# EAGLE design ESP_LoRa_Weather (EAGLE 9.5.2)
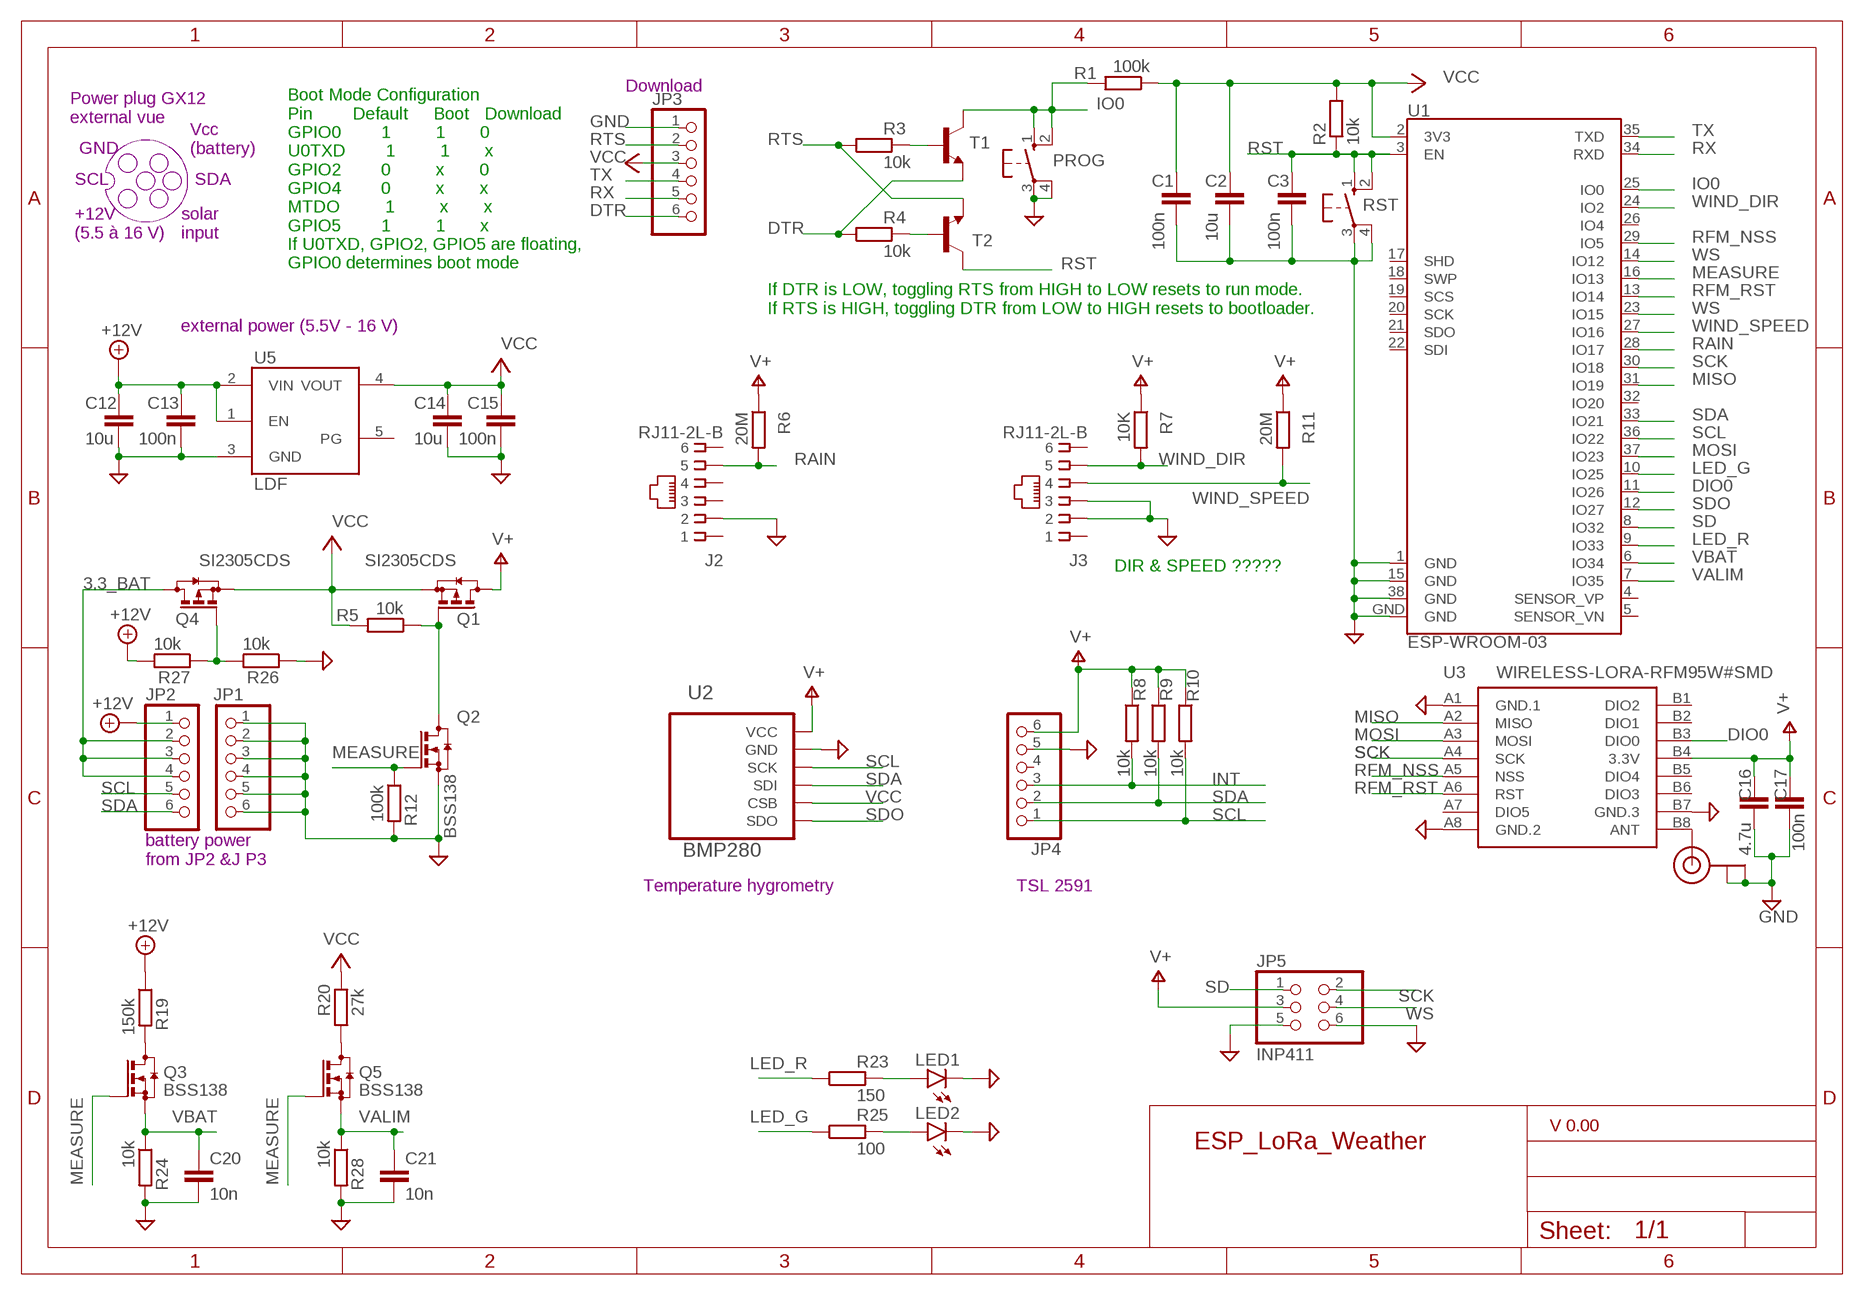
[diagram p0: schematic, sheet 1]

## Parts
C1  100n  CC1206  [C1206]
C2  10u  CC1210  [C1210]
C3  100n  CC1206  [C1206]
C12  10u  CC1210  [C1210]
C13  100n  CC1206  [C1206]
C14  10u  CC1210  [C1210]
C15  100n  CC1206  [C1206]
C16  4.7u  CC1210  [C1210]
C17  100n  CC1206  [C1206]
C20  10n  CC1206  [C1206]
C21  10n  CC1206  [C1206]
J1  U.FL  [U.FL]
J2  RJ11-2L-B  [RJ11-NO_SHIELD]
J3  RJ11-2L-B  [RJ11-NO_SHIELD]
JP1  PINHD-1X6  [1X06]
JP2  PINHD-1X6  [1X06]
JP3  PINHD-1X6  [1X06]
JP4  PINHD-1X6  [1X06]
JP5  INP411  PINHD-2X3  [2X03]
LED1  LEDCHIPLED_0805  [CHIPLED_0805]
LED2  LEDCHIPLED_0805  [CHIPLED_0805]
PROG  10-XX  [B3F-10XX]
Q1  SI2305CDS  [SOT23]
Q2  BSS138  [SOT23]
Q3  BSS138  [SOT23]
Q4  SI2305CDS  [SOT23]
Q5  BSS138  [SOT23]
R1  100k  RR1206  [R1206]
R2  10k  RR1206  [R1206]
R3  10k  RR1206  [R1206]
R4  10k  RR1206  [R1206]
R5  10k  RR1206  [R1206]
R6  20M  RR1206  [R1206]
R7  10K  RR1206  [R1206]
R8  10k  RR1206  [R1206]
R9  10k  RR1206  [R1206]
R10  10k  RR1206  [R1206]
R11  20M  RR1206  [R1206]
R12  100k  RR1206  [R1206]
R19  150k  RR1206  [R1206]
R20  27k  RR1206  [R1206]
R23  150  RR1206  [R1206]
R24  10k  RR1206  [R1206]
R25  100  RR1206  [R1206]
R26  10k  RR1206  [R1206]
R27  10k  RR1206  [R1206]
R28  10k  RR1206  [R1206]
RST  10-XX  [B3F-10XX]
T1  MMBT2222ALT1-NPN-SOT23-BEC  [SOT23-BEC]
T2  MMBT2222ALT1-NPN-SOT23-BEC  [SOT23-BEC]
U1  ESP-WROOM-03  [ESP-WROOM-03]
U2  BMP280  [BMP280]
U3  WIRELESS-LORA-RFM95W#SMD  [WIRELESS-LORA-RFM95W#SMD]
U5  LDF3.3  [PPAK]

## Nets
3.3_BAT: JP2.2 JP2.3 JP2.4 Q4.3(D)
+12V: C12.1 C13.1 JP2.1 R19.1 R27.2 U5.1(EN) U5.2(VIN)
DIO0: U1.11(IO26) U3.B3(DIO0)
DTR: JP3.6 R4.1 T1.E
GND: C1.2 C2.2 C3.2 C12.2 C13.2 C14.2 C15.2 C16.2 C17.2 C20.2 C21.2 J1.1(GND) J1.2(GND) J2.2 J3.2 J3.3 JP1.1 JP1.2 JP1.3 JP1.4 JP1.5 JP1.6 JP3.1 JP4.5 JP5.5 JP5.6 LED1.C LED2.C PROG.3(P) PROG.4(P1) Q2.2(S) R12.2 R24.2 R26.1 R28.2 RST.3(P) RST.4(P1) U1.1(GND) U1.15(GND) U1.38(GND) U1.GND U2.GND U3.A1(GND.1) U3.A8(GND.2) U3.B7(GND.3) U5.3(GND)
INT: JP4.3 R8.2
IO0: PROG.1(S) PROG.2(S1) R1.2 T1.C U1.25(IO0)
LED_G: R25.1 U1.10(IO25)
LED_R: R23.1 U1.9(IO33)
MEASURE: Q2.1(G) Q3.1(G) Q5.1(G) R12.1 U1.16(IO13)
MISO: U1.31(IO19) U3.A2(MISO)
MOSI: U1.37(IO23) U3.A3(MOSI)
N$1: Q1.1(G) Q2.3(D) R5.1
N$2: Q3.3(D) R19.2
N$3: J1.3(SIGNAL) U3.B8(ANT)
N$5: Q5.3(D) R20.1
N$7: LED1.A R23.2
N$8: LED2.A R25.2
N$10: R3.2 T1.B
N$14: R4.2 T2.B
N$35: Q4.1(G) R26.2 R27.1
RAIN: J2.5 R6.2 U1.28(IO17)
RFM_NSS: U1.29(IO5) U3.A5(NSS)
RFM_RST: U1.13(IO14) U3.A6(RST)
RST: C3.1 R2.1 RST.1(S) RST.2(S1) T2.C U1.3(EN)
RTS: JP3.2 R3.1 T2.E
RX: JP3.5 U1.34(RXD)
SCK: JP5.2 U1.30(IO18) U3.A4(SCK)
SCL: JP2.5 JP4.1 R10.2 U1.36(IO22) U2.SCK
SD: JP5.1 U1.8(IO32)
SDA: JP2.6 JP4.2 R9.2 U1.33(IO21) U2.SDI
SDO: U1.12(IO27) U2.SD0(SDO)
TX: JP3.4 U1.35(TXD)
V+: C16.1 C17.1 JP4.6 JP5.3 Q1.3(D) R6.1 R7.1 R8.1 R9.1 R10.1 R11.1 U2.VCC U3.B4(3.3V)
VALIM: C21.1 Q5.2(S) R28.1 U1.7(IO35)
VBAT: C20.1 Q3.2(S) R24.1 U1.6(IO34)
VCC: C1.1 C2.1 C14.1 C15.1 JP3.3 Q1.2(S) Q4.2(S) R1.1 R2.2 R5.2 R20.2 U1.2(3V3) U2.CSB U5.4(VOUT)
WIND_DIR: J3.5 R7.2 U1.24(IO2)
WIND_SPEED: J3.4 R11.2 U1.27(IO16)
WS: JP5.4 U1.14(IO12) U1.23(IO15)
Unconnected: J2.1 J2.3 J2.4 J2.6 J3.1 J3.6 JP4.4 U1.4(SENSOR_VP) U1.5(SENSOR_VN) U1.17(SHD) U1.18(SWP) U1.19(SCS) U1.20(SCK) U1.21(SDO) U1.22(SDI) U1.26(IO4) U1.32(IO20) U3.A7(DIO5) U3.B1(DIO2) U3.B2(DIO1) U3.B5(DIO4) U3.B6(DIO3) U5.5(PG)

## Notes on the sheet
- Download
- Power plug GX12
  external vue
- GND
- Vcc
  (battery)
- SCL | SDA
- +12V
  (5.5 à 16 V)
- solar 
  input
- Boot Mode Configuration
  Pin        Default     Boot   Download
  GPIO0        1         1       0
  U0TXD        1         1       x
  GPIO2        0         x       0
  GPIO4        0         x       x
  MTDO         1         x       x
  GPIO5        1         1       x
  If U0TXD, GPIO2, GPIO5 are floating, 
  GPIO0 determines boot mode
- If DTR is LOW, toggling RTS from HIGH to LOW resets to run mode.
  If RTS is HIGH, toggling DTR from LOW to HIGH resets to bootloader.
- external power (5.5V - 16 V)
- DIR & SPEED ?????
- battery power
  from JP2 &J P3
- Temperature hygrometry | TSL 2591
- V 0.00

## Library data of the parts
C1-C3 C12-C17 C20 C21 = eagle-ltspice:C: CAPACITOR, European symbol; SPICEMODEL: NONE; SPICEPREFIX: C
J1 = microbuilder:U.FL: U.FL Antenna Connector
J2 J3 = con-tycoelectronics:RJ11: CORCOM Modular RJ Jacks No Shield Source: www.tycoelectronics.com .. ENG_DS_1654001_1099_RJ_L_0507.pdf; MF: TYCO ELECTRONICS; MPN: RJ11-2L-B; OC_FARNELL: unknown; OC_NEWARK: 83F4463
JP1-JP4 = pinhead:PINHD-1X6: PIN HEADER
JP5 = pinhead:PINHD-2X3: PIN HEADER
LED1 LED2 = led:LED: LED OSRAM: - CHIPLED LG R971, LG N971, LY N971, LG Q971, LY Q971, LO R971, LY R971 LH N974, LH R974 LS Q976, LO Q976, LY Q976 LO Q996 - Hyper CHIPLED LW Q18S LB Q993, LB Q99A, LB R99A - SideLED LS A670, LO A670, LY A670, LG A670, LP A670 LB A673, LV A673, LT A673, LW A673 LH A674 LY A675 LS A676, LA A676, LO A676, LY A676, LW A676 LS A679, LY A679, LG A679 - Hyper Micro SIDELED® LS Y876, LA Y876, LO Y876, LY Y876 LT Y87S - SmartLED LW L88C, LW L88S LB L89C, LB L89S, LG L890 LS L89K, LO L89K, LY L89K LS L896, LA L896, LO L896, LY L896 - TOPLED LS T670, LO T670, LY T670, LG T670, LP T670 LSG T670, LSP T670, LSY T670, LOP T670, LYG T670 LG T671, LOG T671, LSG T671 LB T673, LV T673, LT T673, LW T673 LH T674 LS T676, LA T676, LO T676, LY T676, LB T676, LH T676, LSB T676, LW T676 LB T67C, LV T67C, LT T67C, LS T67K, LO T67K, LY T67K, LW E67C LS E67B, LA E67B, LO E67B, LY E67B, LB E67C, LV E67C, LT E67C LW T67C LS T679, LY T679, LG T679 LS T770, LO T770, LY T770, LG T770, LP T770 LB T773, LV T773, LT T773, LW T773 LH T774 LS E675, LA E675, LY E675, LS T675 LS T776, LA T776, LO T776, LY T776, LB T776 LHGB T686 LT T68C, LB T68C - Hyper Mini TOPLED® LB M676 - Mini TOPLED Santana® LG M470 LS M47K, LO M47K, LY M47K Source: http://www.osram.convergy.de LUXEON: - LUMILED® LXK2-PW12-R00, LXK2-PW12-S00, LXK2-PW14-U00, LXK2-PW14-V00 LXK2-PM12-R00, LXK2-PM12-S00, LXK2-PM14-U00 LXK2-PE12-Q00, LXK2-PE12-R00, LXK2-PE12-S00, LXK2-PE14-T00, LXK2-PE14-U00 LXK2-PB12-K00, LXK2-PB12-L00, LXK2-PB12-M00, LXK2-PB14-N00, LXK2-PB14-P00, LXK2-PB14-Q00 LXK2-PR12-L00, LXK2-PR12-M00, LXK2-PR14-Q00, LXK2-PR14-R00 LXK2-PD12-Q00, LXK2-PD12-R00, LXK2-PD12-S00 LXK2-PH12-R00, LXK2-PH12-S00 LXK2-PL12-P00, LXK2-PL12-Q00, LXK2-PL12-R00 Source: www.luxeon.com KINGBRIGHT: KA-3528ASYC Source: www.kingbright.com
PROG RST = switch-omron:10-XX: OMRON SWITCH; MPN: B3F-1000; OC_FARNELL: 176432; OC_NEWARK: 36M3542
Q1 Q4 = transistor-small-signal-perso:SI2305CDS: P-CHANNEL MOS FET
Q2 Q3 Q5 = detect:BSS138: N-CHANNEL MOS FET
R1-R12 R19 R20 R23-R28 = eagle-ltspice:R: RESISTOR, European symbol; SPICEMODEL: NONE; SPICEPREFIX: R
T1 T2 = transistor:*-NPN-: NPN Transistror BF959 corrected 2008.03.06
U1 = esp32-sparkfun (1):ESP-WROOM-03; OC_FARNELL: unknown
U2 = BMP280:BMP280: BMP280 Barometer Breakout Board
U3 = diy-modules:WIRELESS-LORA-RFM95W: 868/915 MHz LoRa Radio Transceiver Module based on SX1276 chip Click here to find device on ebay.com <http://www.ebay.com/sch/RFM95W+transceiver>
U5 = LDO:LDF: LDFxx 1 A very low drop voltage regulator

## Board
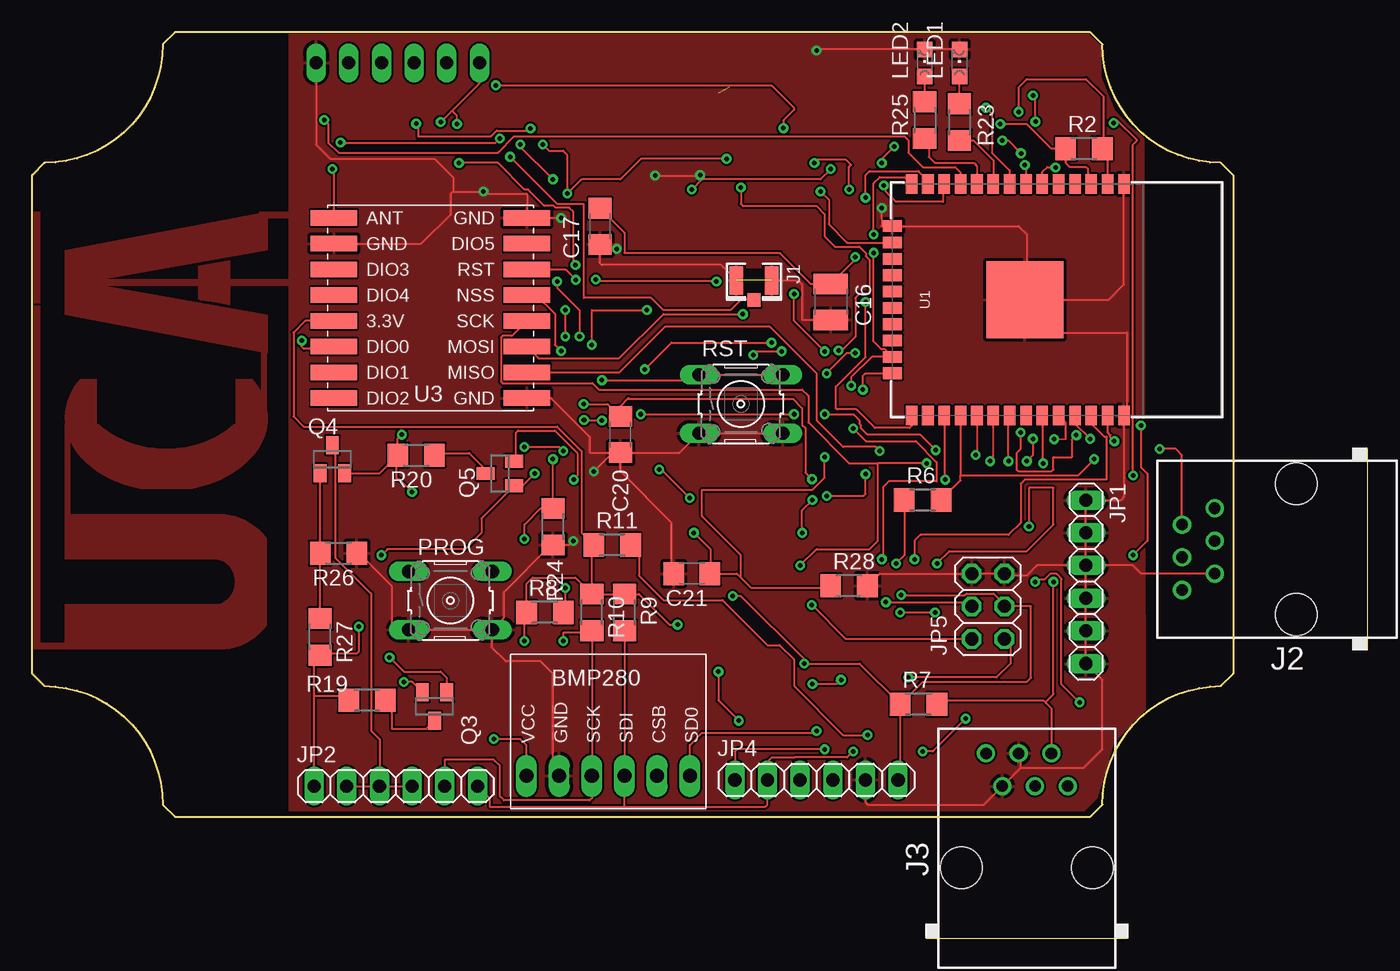
[diagram p1: board, top side]
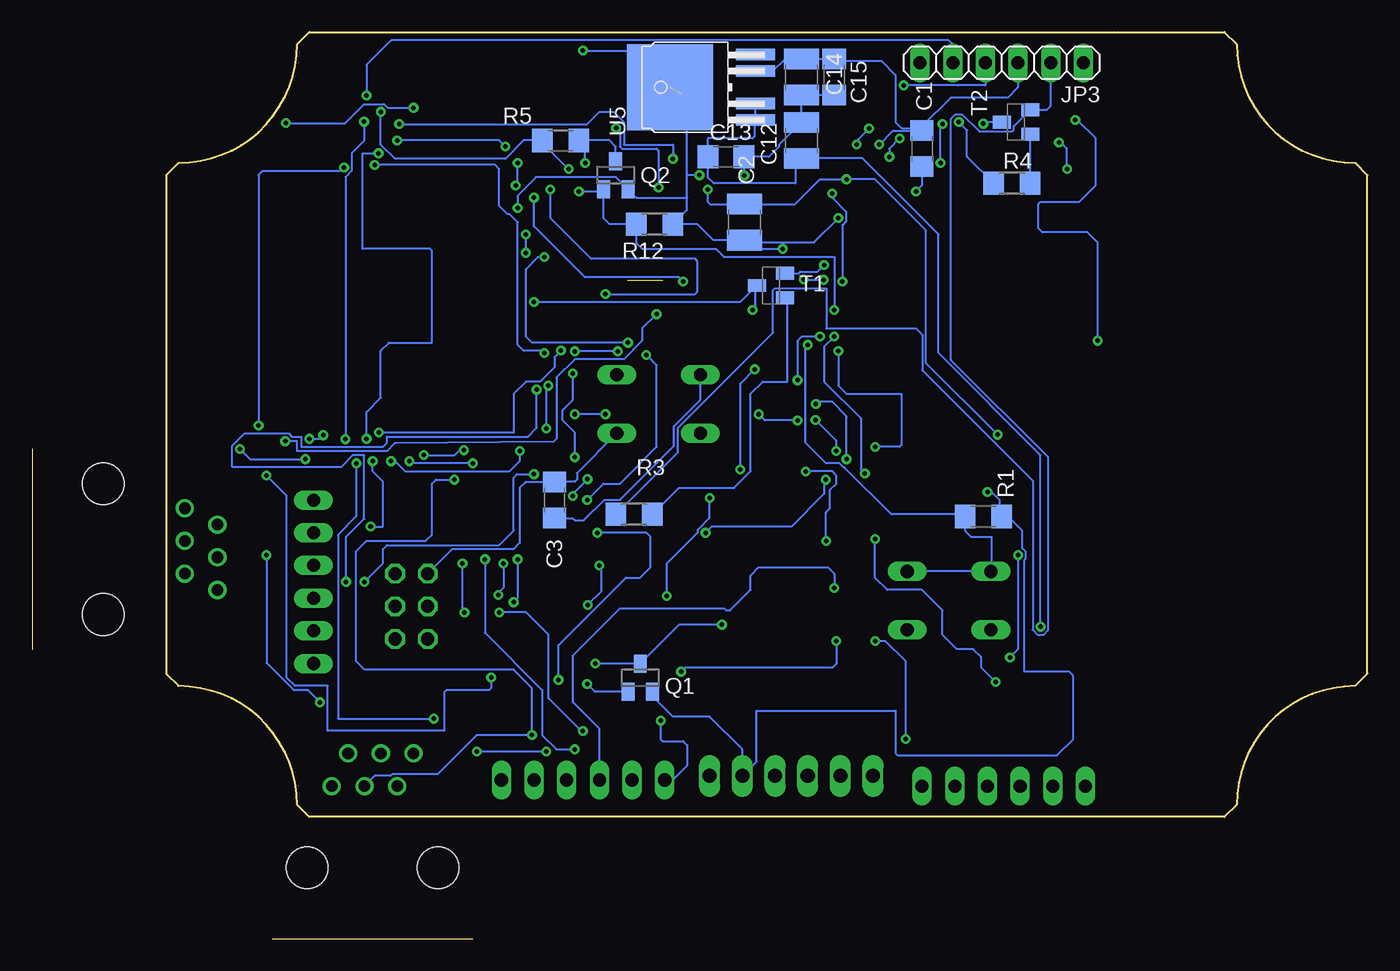
[diagram p2: board, bottom side, seen from below]

Size 93.34 x 60.96 mm. Coordinates in mm from the lower left corner, seen from the top.
Outline: 82.23,60.96 19.37,60.96 11.11,60.96 10.16,60.01 arc-90 0.95,50.8 0,49.85 0,11.11 0.95,10.16 arc-90 10.16,0.95 11.11,0 82.23,0 83.19,0.95 arc-90 92.39,10.16 93.34,11.11 93.34,49.85 92.39,50.8 arc-90 83.19,60.01 82.23,60.96
Copper layers (1*16): Top 0.035mm / dielectric 1.5mm / Bottom 0.035mm
Design rules "default *": minimum track width 6mil, minimum drill 0.35mm, track to track 6mil, track to pad 6mil, pad to pad 6mil, via to via 6mil, smd to smd 6mil, copper to edge 0mil, drill to drill 6mil, minimum pad ring 10mil, minimum via ring 8mil, stop-mask expansion 4mil, vias tented up to drill 0mil, thermal gap 10mil

### Footprints (pad centres in the part's own frame; a part is rotated, then mirrored left to right if it is on the bottom)
C1206 = smd 1.6 x 1.8: 1 -1.4,0; 2 1.4,0
C1210 = smd 1.6 x 2.7: 1 -1.4,0; 2 1.4,0
U.FL = smd 2.2 x 1.05: 1 0,1.375; 2 0,-1.375 | smd 1.05 x 1: 3 1.525,0
RJ11-NO_SHIELD = drill 0.9 pad 1.4: 1 -3.175,8.89; 2 -1.905,6.35; 3 -0.635,8.89; 4 0.635,6.35; 5 1.905,8.89; 6 3.175,6.35 | hole 3.251: -5.08,0; 5.08,0
1X06 = drill 1.016 long: 1 -6.35,0; 2 -3.81,0; 3 -1.27,0; 4 1.27,0; 5 3.81,0; 6 6.35,0
2X03 = drill 1.016 octagon: 1 -2.54,-1.27; 2 -2.54,1.27; 3 0,-1.27; 4 0,1.27; 5 2.54,-1.27; 6 2.54,1.27
CHIPLED_0805 = smd 1.2 x 1.2: A 0,-1.05; C 0,1.05
B3F-10XX = drill 1.016 long: 1 -3.251,2.261; 2 3.251,2.261; 3 -3.251,-2.261; 4 3.251,-2.261
SOT23 = smd 1 x 1.4: 1 -0.95,-1.1; 2 0.95,-1.1; 3 0,1.1
R1206 = smd 1.6 x 1.803: 1 -1.422,0; 2 1.422,0
SOT23-BEC = smd 1 x 1.4: B -0.95,-1.1; C 0,1.1; E 0.95,-1.1
ESP-WROOM-03 = smd 0.9 x 1.5: 1 7.7,9; 2 6.43,9; 3 5.16,9; 4 3.89,9; 5 2.62,9; 6 1.35,9; 7 0.08,9; 8 -1.19,9; 9 -2.46,9; 10 -3.73,9; 11 -5,9; 12 -6.27,9; 13 -7.54,9; 14 -8.81,9; 25 -8.81,-9; 26 -7.54,-9; 27 -6.27,-9; 28 -5,-9; 29 -3.73,-9; 30 -2.46,-9; 31 -1.19,-9; 32 0.08,-9; 33 1.35,-9; 34 2.62,-9; 35 3.89,-9; 36 5.16,-9; 37 6.43,-9; 38 7.7,-9 | smd 1.5 x 0.9: 15 -10.3,5.715; 16 -10.3,4.445; 17 -10.3,3.175; 18 -10.3,1.905; 19 -10.3,0.635; 20 -10.3,-0.635; 21 -10.3,-1.905; 22 -10.3,-3.175; 23 -10.3,-4.445; 24 -10.3,-5.715 | smd 6 x 6: GND 0,0
BMP280 = drill 1.1 long: CSB 2.54,-3.81; GND 2.54,3.81; SCK 2.54,1.27; SD0 2.54,-6.35; SDI 2.54,-1.27; VCC 2.54,6.35
WIRELESS-LORA-RFM95W#SMD = smd 3.6 x 1.2: A1 -7.5,7; A2 -7.5,5; A3 -7.5,3; A4 -7.5,1; A5 -7.5,-1; A6 -7.5,-3; A7 -7.5,-5; A8 -7.5,-7; B1 7.5,7; B2 7.5,5; B3 7.5,3; B4 7.5,1; B5 7.5,-1; B6 7.5,-3; B7 7.5,-5; B8 7.5,-7
PPAK = smd 0.9 x 3: 1 -2.54,-1.5; 2 -1.27,-1.5; 4 1.27,-1.5; 5 2.54,-1.5 | smd 6.7 x 6.7: 3 0,5.15

### Placement (x,y rotation side)
C1  34.61,51.91 270 bottom
C2  48.42,46.2 270 bottom
C3  63.18,24.61 90 bottom
C12  43.97,52.55 90 bottom
C13  49.85,51.28 0 bottom
C14  43.97,57.47 270 bottom
C15  41.43,57.47 270 bottom
C16  62.07,40.01 270 top
C17  44.13,45.88 270 top
C20  45.72,29.69 270 top
C21  51.28,18.89 180 top
J1  56.12,41.68 270 top
J2  98.27,20.8 90 top
J3  77.31,-3.97 0 top
JP1  81.92,18.26 270 top
JP2  28.26,2.38 0 top
JP3  28.42,58.58 180 bottom
JP4  60.96,2.86 0 top
JP5  74.3,16.35 90 top
LED1  72.07,58.58 0 top
LED2  69.37,58.58 0 top
PROG  32.51,16.8 0 top
Q1  56.52,10.79 0 bottom
Q2  58.42,49.85 0 bottom
Q3  31.27,8.57 180 top
Q4  23.34,27.78 0 top
Q5  36.35,26.67 90 top
R1  29.84,23.34 180 bottom
R2  81.76,51.91 0 top
R3  56.99,23.5 0 bottom
R4  27.62,49.21 0 bottom
R5  62.71,52.55 180 bottom
R6  69.22,24.61 0 top
R7  68.9,8.73 0 top
R8  39.85,15.88 0 top
R9  46.04,15.88 270 top
R10  43.5,15.88 270 top
R11  45.09,21.11 0 top
R12  55.4,46.04 0 bottom
R19  26.04,9.05 0 top
R20  29.84,28.1 180 top
R23  72.07,53.98 90 top
R24  40.48,22.54 270 top
R25  69.37,54.13 90 top
R26  23.81,20.48 180 top
R27  22.38,13.97 270 top
R28  63.5,17.94 0 top
RST  55.09,32.07 0 top
T1  46.35,41.27 90 bottom
T2  27.3,53.98 90 bottom
U1  77.16,40.17 0 top
U2  44.77,0.64 90 top
U3  30.96,39.53 180 top
U5  49.05,56.67 90 bottom

### Tracks (layer width: path | path; a pad name or v marks a point on that pad's centre or on a via)
3.3_BAT
  Top 0.152: Q4.3 23.56,28.66 23.56,20.13 26.35,17.34 26.35,6.67 26.99,6.03 JP2.3 | JP2.2 JP2.3 | JP2.3 JP2.4
+12V  (via drill 0.35)
  Top 0.152: JP2.1 21.91,9.37 | 21.91,9.37 21.91,12.07 R27.2 22.54,12.7 25.24,12.7 25.4,12.86 v25.4,14.76 | R19.1 24.3,9.37 21.91,9.37
  Bottom 0.152: U5.2 U5.1 47.62,54.06 47.62,52.86 47.78,52.7 51.28,52.7 51.28,51.3 C13.1 51.25,49.66 50.8,49.21 44.45,49.21 44.45,50.67 C12.1 39.24,51.15 33.34,45.24 33.34,36.04 25.4,28.1 v25.4,14.76
ANT
  pour Top: 14.99,13 0.14,13 0.14,39.7 0.64,39.7 0.64,13.5 2.54,13.5 2.54,16.5 14.19,16.5 14.32,16.51 14.46,16.53 14.59,16.56 14.73,16.61 14.85,16.67 14.97,16.74 15.09,16.82 15.2,16.91 15.3,17.02 15.39,17.13 15.48,17.25 15.55,17.38 15.61,17.51 15.67,17.65 15.71,17.8 15.74,17.95 15.76,18.1 15.76,18.25 15.76,18.41 15.74,18.56 15.71,18.71 15.67,18.85 15.61,18.99 15.55,19.13 15.48,19.25 15.39,19.38 15.3,19.49 15.2,19.59 15.09,19.69 14.97,19.77 14.85,19.84 14.73,19.9 14.59,19.94 14.46,19.98 14.32,20 14.19,20 2.54,20 2.54,30.5 2.57,30.5 2.55,31.11 2.61,31.73 2.75,32.32 2.99,32.92 3.31,33.49 3.72,34 5.03,34 5.03,30.5 5.17,30.5 5.5,30.21 5.85,29.95 6.22,29.7 6.63,29.48 7.06,29.27 7.5,29.1 7.96,28.95 8.44,28.82 8.92,28.73 9.42,28.66 9.92,28.61 10.42,28.6 10.92,28.61 11.42,28.66 11.92,28.73 12.41,28.82 12.88,28.95 13.35,29.1 13.78,29.27 14.21,29.48 14.62,29.7 14.99,29.95 15.34,30.21 15.67,30.5 15.82,30.5 15.82,34 17.13,34 17.25,33.85 17.37,33.69 17.49,33.53 17.59,33.37 17.69,33.21 17.79,33.04 17.79,36.1 2.54,39 2.54,44 17.64,46.87 17.64,47 20.14,47 20.14,46.99 23.99,46.99 23.99,45.99 19.99,45.99 19.99,46.5 18.31,46.5 18.31,44 5.61,41.75 12.91,41.75 12.91,42.8 15.4,43.25 15.4,41.75 19.99,41.75 19.99,42 20.39,42 20.39,41 19.99,41 19.99,41.25 15.4,41.25 15.4,39.75 14.21,39.97 13.08,40.14 13.08,40.17 12.91,40.2 12.91,41.25 5.61,41.25 18.31,39 18.31,36 18.24,36.02 18.24,31.76 18.3,31.22 18.29,30.67 18.21,30.13 18.06,29.58 17.83,29.06 17.55,28.56 17.18,28.07 16.76,27.62 16.3,27.2 15.76,26.8 15.17,26.46 14.57,26.15 13.89,25.88 13.2,25.66 12.49,25.5 8.35,25.5 7.75,25.64 7.15,25.81 6.57,26.03 6.03,26.27 5.51,26.54 5.02,26.85 4.58,27.18 4.16,27.53 3.79,27.92 3.47,28.32 3.19,28.74 2.95,29.18 2.95,23.5 14.99,23.5 14.99,23.49 15.4,23.43 15.81,23.34 16.21,23.21 16.59,23.03 16.96,22.82 17.31,22.58 17.65,22.3 17.96,21.99 18.24,21.65 18.24,14.85 17.96,14.52 17.65,14.2 17.31,13.93 16.96,13.68 16.59,13.47 16.21,13.3 15.81,13.17 15.4,13.07 14.99,13.02
ANT1
  pour Top: 0.64,39.9 0.14,39.9 0.14,47 0.64,47
DIO0  (via drill 0.35)
  Top 0.152: U3.B3 23.28,36.35 21.11,36.35 20.95,36.51 v20.95,36.99 | v22.7,54.13 23.02,53.82 23.02,52.39 23.81,51.59 36.2,51.59 37.47,52.86 67.79,52.86 68.1,52.55 68.1,51.59 69.22,50.48 71.75,50.48 72.16,50.08 U1.11
  Bottom 0.152: v20.95,36.99 20.95,44.61 21.75,45.4 25.24,45.4 25.56,45.72 25.56,47.62 25.4,47.78 22.38,47.78 21.11,49.05 21.11,52.7 22.54,54.13 v22.7,54.13
DTR  (via drill 0.35)
  Top 0.152: v31.75,53.98 32.62,54.85 | 32.62,54.85 34.77,56.99 JP3.6 | v42.23,42.86 42.07,43.02 42.07,46.99 41.74,47.32 40.67,47.32 40.53,47.47 39.8,47.47 38.54,48.72 38.27,48.72 36.2,50.8 v33.18,50.8 | v33.02,53.82 33.02,54.45 32.62,54.85
  Bottom 0.152: R4.1 31.11,51.28 31.11,53.34 v31.75,53.98 | T1.E 44.2,42.23 44.07,42.36 42.73,42.36 v42.23,42.86 | v33.18,50.8 33.18,53.66 v33.02,53.82
GND  (via drill 0.35)  (2 unrouted)
  Top 0.152: 25.4,20.31 R26.1 25.4,20.48 27.94,17.94 27.94,14.61 28.01,14.54 PROG.3 PROG.4 | 38.47,46.51 U3.A8 | 38.47,46.51 38.47,48.37 38.42,48.42 35.24,48.42 v35.08,48.58 32.7,48.58 | U3.B7 30.24,44.53 32.54,46.83 32.54,48.42 32.7,48.58 | JP3.1 22.07,52.23 23.18,51.12 31.27,51.12 32.7,49.69 32.7,48.58 | JP4.5 64.77,1.11 64.93,0.95 73.98,0.95 J3.2 76.83,3.81 | 76.83,3.81 76.83,4.76 J3.3 | 76.83,3.81 81.76,3.81 83.19,5.24 83.19,10.64 JP1.6 JP1.5 JP1.4 81.92,19.37 | 81.92,19.37 JP1.3 | JP1.3 JP1.2 JP1.1 84.61,24.61 84.86,24.86 84.86,31.11 | U1.38 84.86,31.11 | 84.86,31.11 85.09,31.34 85.09,37.62 79.71,37.62 U1.GND 77.31,40.17 | 77.31,40.17 83.67,40.17 84.86,41.37 U1.1 | 77.31,40.17 77.31,45.24 76.67,45.89 U1.15 66.04,45.89 v66.04,47.31 | LED1.C LED2.C 61.06,59.63 v60.96,59.53 | U2.GND 40.48,3.65 40.48,11.11 39.53,12.06 36.83,12.06 35.76,13.13 PROG.4 | J2.2 86.2,18.89 85.57,19.53 82.07,19.53 81.92,19.37 | JP1.3 78.11,19.53 77.31,18.73 75.72,18.73 JP5.5 JP5.6 65.87,18.89 R28.2 | U3.A1 40.34,32.53 43.34,29.53 43.34,28.29 C20.2 | C21.2 49.69,19.08 49.69,22.86 45.72,26.83 45.72,27.94 | 45.72,27.94 C20.2 | C20.2 50.31,28.29 RST.3 RST.4 | v41.12,46.51 38.47,46.51 | v48.42,49.82 51.88,49.82 v51.91,49.85 | J1.1 59.56,41.68 59.85,41.38 59.85,38.6 C16.2 | J1.2 53.53,42.89 44.32,42.89 44.29,42.86 44.13,43.02 44.13,44.13 | PROG.4 36.67,15.44 36.67,17.46 40.33,21.12 R24.2 41.76,21.12 v42.07,21.43 | v43.66,26.83 44.77,27.94 45.72,27.94 | 44.13,44.13 C17.2 | v45.43,44.13 44.13,44.13
  Bottom 0.152: 52.07,54.93 53.34,56.2 | 63.88,26.71 63.2,26.02 | 63.2,26.02 C3.2 65.43,26.01 65.88,25.56 65.88,21.27 66.36,20.8 71.12,20.8 JP5.6 | C12.2 45.11,53.95 | C12.2 43.53,53.5 | C12.2 C14.2 C15.2 | C12.2 45.72,52.2 45.72,52.07 46.51,51.28 C13.2 48.45,49.85 v48.42,49.82 | C1.2 34.61,49.05 v35.08,48.58 | 52.86,48.1 52.86,47.16 R12.2 52.07,46.04 50.83,44.8 C2.2 | 52.86,48.1 52.86,49.85 | 52.86,49.85 52.86,55.33 U5.3 57.06,59.53 v60.96,59.53 | 52.86,48.1 56.82,48.1 Q2.2 58.41,49.69 64.61,49.69 66.04,48.26 v66.04,47.31 | RST.4 61.44,26.71 61.44,26.19 61.61,26.02 63.2,26.02 | C2.2 48.26,44.64 42.99,44.64 v41.12,46.51 | v51.91,49.85 52.86,49.85 | v42.07,21.43 42.07,23.65 41.75,23.97 41.75,25.4 41.27,25.88 41.27,26.51 41.59,26.83 v43.66,26.83 | C2.2 47.76,44.13 v45.43,44.13
  pour Top: 20,0.48 20,60.8 82.07,60.8 83.03,59.85 83.03,57.47 84.06,54.89 85.3,53.57 86.04,53.02 86.36,52.7 86.48,8.3 85.69,7.56 83.98,5.71 82.71,1.43 81.76,0.48
INT  (via drill 0.35)
  Top 0.152: v41.43,17.78 41.43,16.04 R8.2
  Bottom 0.152: JP4.3 59.69,6.83 61.75,8.89 61.75,12.54 58.1,16.19 50.01,16.19 49.85,16.03 49.53,16.03 47.94,17.62 47.94,18.73 47.31,19.37 41.91,19.37 41.43,18.89 v41.43,17.78
IO0  (via drill 0.35)
  Top 0.152: 68.26,31.08 U1.25 68.35,30.38 68.19,30.22 65.5,30.22 64.07,31.65 62.56,31.65 62.47,31.74 62.47,33.42 | v64.77,40.01 64.77,35.72 62.47,33.42 | 62.47,33.42 62.45,33.4 | v43.5,36.67 43.5,39.37 v47.78,39.37
  Bottom 0.152: PROG.2 PROG.1 29.21,19.11 29.21,21.75 30.8,21.75 31.27,22.22 R1.2 31.43,23.5 36.99,23.5 40.67,27.17 40.73,27.17 41.02,27.46 42.07,27.46 43.66,29.05 43.66,36.51 v43.5,36.67 | v64.77,40.01 48.73,40.01 47.54,41.19 | 47.54,41.19 T1.C | v47.78,39.37 47.54,39.61 47.54,41.19
LED_G
  Top 0.152: R25.1 69.69,52.39 69.69,51.28 70.17,50.8 73.18,50.8 73.43,50.55 U1.10
LED_R
  Top 0.152: R23.1 73.18,52.55 74.7,51.03 U1.9
MEASURE  (via drill 0.35)
  Top 0.152: v27.15,20.32 27.62,20.8 33.66,20.8 34.92,22.07 34.92,23.19 Q5.1 38.1,25.72 v39.05,26.67 | v27.78,12.38 28.89,11.27 31.75,11.27 32.22,10.8 Q3.1 | v61.28,48.58 61.91,47.94 61.91,46.04 63.33,44.62 U1.16 | v41.43,39.37 v41.43,37.31
  Bottom 0.152: v27.78,12.38 27.15,13.02 v27.15,20.32 | v61.28,48.58 59.54,48.58 Q2.1 59.37,46.51 58.9,46.04 R12.1 56.83,44.6 56.36,44.13 50.64,44.13 50.01,43.5 41.43,43.5 v41.43,39.37 | v41.43,37.31 42.23,36.51 42.23,33.81 39.37,30.96 39.37,26.99 v39.05,26.67
MISO  (via drill 0.35)
  Top 0.152: U3.A2 45.64,34.53 49.21,38.1 57.31,38.1 60.96,34.45 60.96,30.8 63.02,28.73 65.56,28.73 v65.88,28.42 | v75.88,27.62 75.88,31.08 U1.31
  Bottom 0.152: v65.88,28.42 65.88,27.62 66.67,26.83 74.77,26.83 75.56,27.62 v75.88,27.62
MOSI  (via drill 0.35)
  Top 0.152: U3.A3 39.4,35.59 45.59,35.59 49.05,39.05 v55.24,39.05 | v84.11,29.18 83.81,29.48 83.81,29.65 83.59,29.87 U1.37
  Bottom 0.152: v55.24,39.05 56.36,37.94 56.36,36.99 57.78,35.56 61.59,35.56 63.02,34.13 63.02,29.37 63.24,29.16 75.59,29.02 76.2,28.42 83.19,28.42 83.19,29.19 v84.11,29.18
N$1  (via drill 0.35)
  Top 0.152: v60.64,10.32 62.55,10.32 v62.87,10.64 | v59.85,22.07 59.85,23.81 v60.64,24.61 | v56.04,35.88 56.33,36.17 v58.26,36.17 | v61.59,36.17 59.21,38.55 v59.21,40.61 | v63.5,48.74 63.5,50.48 63.66,50.64 63.26,51.04 61.04,51.04 v60.8,50.8
  Bottom 0.152: Q2.3 58.42,52.07 58.9,52.55 R5.1 60.8,52.06 v60.8,50.8 | Q1.1 60.02,9.7 v60.64,10.32 | v62.87,10.64 62.87,13.34 57.63,18.57 56.52,18.57 55.72,19.37 55.72,21.75 56.04,22.07 v59.85,22.07 | v60.64,24.61 59.37,25.88 58.1,25.88 55.24,28.73 55.24,35.08 v56.04,35.88 | v58.26,36.17 v61.59,36.17 | v59.21,40.61 52.26,40.61 52.07,40.8 52.07,43.18 52.23,43.34 60.33,43.34 63.5,46.51 v63.5,48.74
N$2
  Top 0.152: R19.2 27.94,8.57 27.94,6.83 30.63,6.83 Q3.3
N$3  (via drill 0.35)
  Top 0.152: 23.41,46.57 U3.B8 23.46,50.2 v23.34,50.32 | J1.3 55.07,40.15 54.29,39.37 49.05,39.37 48.1,40.32 42.86,40.32 42.86,47.62 40.8,47.62 v37.15,51.28 | v23.97,52.39 36.04,52.39 v36.35,52.7
  Bottom 0.152: v23.34,50.32 23.34,51.91 23.81,52.39 v23.97,52.39 | v36.35,52.7 37.15,51.91 v37.15,51.28
N$5
  Top 0.152: R20.1 31.43,28.26 33.97,28.26 35.25,26.98 Q5.3
N$7
  Top 0.152: R23.2 LED1.A
N$8
  Top 0.152: R25.2 LED2.A
N$10
  Bottom 0.152: R3.2 53.51,25.56 49.21,25.56 47.94,26.83 47.94,32.86 46.99,33.81 45.09,33.81 45.09,40.16 T1.B
N$14
  Bottom 0.152: R4.2 T2.B
N$35
  Top 0.152: Q4.1 R26.2 R27.1
RAIN  (via drill 0.35)
  Top 0.152: R6.2 72.16,26.13 72.16,26.51 | J2.5 89.38,28.1 88.9,28.57 v87.63,28.57 | v82.55,27.78 81.28,26.51 72.16,26.51 | U1.28 72.16,26.51
  Bottom 0.152: v87.63,28.57 86.84,27.78 v82.55,27.78
RFM_NSS  (via drill 0.35)
  Top 0.152: U1.29 73.43,28.19 v73.34,28.1 | v70.23,28.48 69.03,29.69 64.93,29.69 64.42,30.19 64.42,30.41 64.29,30.54 64.29,30.8 63.82,31.27 v61.59,31.27 | U3.A5 39.18,40.53 40.64,39.07 40.64,36.67 v41.12,36.2 | v38.26,28.73 40.96,28.73 v41.27,28.42 | v42.9,30.83 42.93,30.8 v44.29,30.8 | v47.31,31.27 v59.21,31.27
  Bottom 0.152: v73.34,28.1 70.93,28.1 70.39,28.64 v70.23,28.48 | v41.12,36.2 41.12,33.5 40.48,32.86 36.2,32.86 36.2,28.89 36.35,28.73 v38.26,28.73 | v41.27,28.42 41.27,29.21 v42.9,30.83 | v44.29,30.8 46.83,30.8 v47.31,31.27 | v59.21,31.27 v61.59,31.27
RFM_RST  (via drill 0.35)
  Top 0.152: U3.A6 41.44,42.53 v42.26,41.72 | v53.18,41.59 43.97,41.59 v43.81,41.75 | v64.77,48.1 64.77,49.85 65.09,50.16 68.9,50.16 69.62,49.44 U1.13
  Bottom 0.152: v43.81,41.75 43.78,41.72 v42.26,41.72 | v53.18,41.59 53.5,41.91 60.8,41.91 64.77,45.88 v64.77,48.1
RST  (via drill 0.35)
  Top 0.152: U1.3 82.07,49.42 82.07,50.32 81.92,50.48 80.64,50.48 80.33,50.79 R2.1 79.22,51.91 77.31,53.82 v75.25,53.82 | RST.1 51.91,34.33 | 51.91,34.33 RST.2 | v29.84,53.85 30,53.69 30,52.86 35.66,52.86 36.1,53.31 38.58,53.31 v38.73,53.47 | v39.69,52.23 40.16,51.75 41.27,51.75 41.59,51.44 v41.59,48.42 42.7,49.53 45.72,49.53 47.31,51.12 v53.98,51.12 | v40.8,41.59 40.8,41.12 42.55,39.37 v42.55,37.31 | v44.29,33.92 51.51,33.92 51.91,34.33
  Bottom 0.152: C3.1 61.78,23.21 61.59,23.02 60.91,23.02 59.31,24.62 58.08,24.62 53.89,28.82 53.89,30.34 51.84,32.4 RST.1 | T2.C 29.69,53.98 29.84,53.82 v29.84,53.85 | v38.73,53.47 39.69,52.52 v39.69,52.23 | v41.59,48.42 41.59,48.1 40.51,47.02 40.51,46.26 40.8,45.97 v40.8,41.59 | v42.55,37.31 43.97,37.31 44.29,36.99 v44.29,33.92 | v75.25,53.82 60.64,53.82 59.69,54.77 58.58,54.77 57.78,53.98 57.78,52.23 53.98,52.23 v53.98,51.12
RTS
  Bottom 0.152: JP3.2 24.61,55.24 24.93,54.92 T2.E 27.48,53.65 27.48,53.38 27.61,53.25 30.16,53.25 31.5,54.58 32,54.58 32.36,54.23 32.36,35.49 24.79,27.92 24.79,14.51 25.15,14.16 25.65,14.16 26.01,14.51 26.01,26.1 34.59,34.69 34.59,37.45 35.08,37.94 42.04,37.94 42.04,41.05 46.05,41.05 46.18,40.92 46.18,37.62 53.59,30.22 53.59,28.32 R3.1
RX  (via drill 0.35)
  Top 0.152: v77.79,56.04 77.95,55.88 77.95,53.98 v77.98,54.01 | v79.43,29.34 80.33,29.37 80.33,30.63 U1.34
  Bottom 0.152: JP3.5 32.23,60.01 32.55,60.33 75.88,60.33 77.79,58.42 v77.79,56.04 | v77.98,54.01 77.98,52.51 78.93,51.57 78.93,50.2 79.43,49.7 v79.43,29.34
SCK  (via drill 0.35)
  Top 0.152: JP5.2 63.25,13.81 v60.59,16.46 | U3.A4 37.28,37.36 36.56,37.36 36.43,37.22 36.43,33.83 36.56,33.7 43.54,33.7 44.06,33.18 59.85,33.18 60.33,32.7 60.33,30.64 63.5,27.46 65.72,27.46 | v74.45,27.62 74.7,27.87 U1.30 | v69.53,27.46 65.72,27.46 | v59.69,19.53 60.96,20.8 65.09,20.8 65.72,21.43 65.72,27.46
  Bottom 0.152: v69.53,27.46 74.3,27.46 v74.45,27.62 | v60.59,16.46 59.53,17.53 59.53,19.37 v59.69,19.53
SCL  (via drill 0.35)
  Top 0.152: JP2.5 32.07,4.45 35.88,4.45 36.35,3.97 36.35,1.59 36.67,1.27 43.34,1.27 43.5,1.43 U2.SCK R10.2 43.33,14.29 41.27,14.29 v41.27,13.65 | U1.36 82.32,30.55 83.34,29.53 83.5,29.53 83.5,26.19 77.15,26.19 76.83,25.88 76.83,22.86 75.88,21.91 69.06,21.91 68.58,21.43 v68.58,20 | v61.59,5.24 54.77,5.24 54.61,5.08 JP4.1 | v53.34,11.27 53.34,9.05 v54.93,7.46
  Bottom 0.152: v68.58,20 68.58,14.29 64.14,9.84 64.14,6.35 63.02,5.24 v61.59,5.24 | v41.27,13.65 41.27,11.91 41.59,11.59 53.02,11.59 v53.34,11.27 | v54.93,7.46 54.93,6.03 54.77,5.87 53.18,5.87 52.86,5.56 52.86,3.97 53.98,2.86 JP4.1
SD  (via drill 0.35)
  Top 0.152: JP5.1 76.04,13.34 76.04,11.91 74.96,10.82 v68.1,10.82 | v85.57,26.51 85.57,52.23 85.88,52.55 84.3,54.13 v84.06,53.9 | v74.14,55.09 74.61,54.61 74.61,51.59 75.97,50.23 U1.8
  Bottom 0.152: v68.1,10.82 68.1,10 68.26,9.84 71.6,9.84 71.75,9.68 71.75,6.67 80.8,6.67 80.8,10.16 83.34,10.16 83.98,10.79 83.98,24.92 v85.57,26.51 | v84.06,53.9 79.45,53.9 77.97,55.38 76.42,55.38 76.14,55.09 v74.14,55.09
SDA  (via drill 0.35)
  Top 0.152: R9.2 U2.SDI 46.04,0.79 | JP2.6 35.56,1.43 35.56,0.79 46.04,0.79 | 46.04,0.79 56.99,0.79 57.15,0.95 JP4.2 57.15,4.29 57.47,4.6 59.27,4.6 59.28,4.61 63.35,4.61 v63.82,5.08 | U1.33 78.51,27.46 v78.58,27.46 | v72.55,7.62 70.01,5.08 v69.22,5.08
  Bottom 0.152: v78.58,27.46 78.58,23.34 80.01,21.91 80.01,7.62 v72.55,7.62 | v69.22,5.08 v63.82,5.08
SDO  (via drill 0.35)
  Top 0.152: U2.SD0 51.12,5.56 52.07,6.51 60.8,6.51 v60.96,6.67 | v67.47,15.88 v70.17,15.88 | v70.33,19.68 71.28,20.64 77.31,20.64 79.38,22.7 79.38,25.56 77.47,25.56 v77.47,22.54 | v77.31,27.62 77.79,28.1 v77.79,29.37 | U1.12 70.8,49.08 70.8,47.78 67.15,47.78 66.36,48.58 66.36,49.05 v66.2,49.05 | v66.04,50.8 66.04,51.12 v66.99,52.07 | v75.41,52.55 75.86,52.55 v76.86,51.55
  Bottom 0.152: v60.96,6.67 61.12,6.67 63.66,9.21 63.66,14.13 65.41,15.88 v67.47,15.88 | v70.17,15.88 70.33,16.03 v70.33,19.68 | v77.47,22.54 76.52,22.54 76.52,26.04 77.31,26.83 v77.31,27.62 | v77.79,29.37 77.79,31.43 76.68,32.54 76.68,36.2 76.04,36.83 72.71,36.83 72.71,43.97 72.87,44.13 78.11,44.13 78.11,51.55 v76.86,51.55 | v66.2,49.05 66.04,49.21 v66.04,50.8 | v66.99,52.07 67.47,52.55 v75.41,52.55
TX  (via drill 0.35)
  Top 0.152: U1.35 81.05,30.55 v82.23,29.37 | v36.04,56.83 57.47,56.83 59.21,55.09 59.21,54.93 58.39,54.11 v58.39,53.5 | v55.09,48.9 55.09,47.62 55.24,47.47 60.96,47.47 61.59,46.83 61.59,45.09 62.39,44.29 64.29,44.29 64.8,43.79 64.8,43.56 65.09,43.27 65.09,40.64 64.29,40.64 63.98,40.32 63.98,37.31 62.89,36.22 v62.67,36.22 | v81.16,29.65 80.8,29.29 80.8,27.94 79.38,27.94 79.38,26.99 79.22,26.83 76.68,26.83 76.52,26.99 76.52,28.26 76.83,28.57 v76.83,29.85
  Bottom 0.152: v82.23,29.37 81.44,29.37 v81.16,29.65 | JP3.4 29.69,56.83 31.81,56.83 31.82,56.83 35.18,56.83 v36.04,56.83 | v58.39,53.5 58.1,53.21 58.1,52.07 57.94,51.91 55.24,51.91 55.09,51.75 v55.09,48.9 | v62.67,36.22 63.18,35.71 63.18,34.92 64.29,33.81 65.41,33.81 66.36,32.86 66.36,29.84 v76.82,29.84 v76.83,29.85
V+  (via drill 0.35)
  Top 0.152: 23.5,38.58 U3.B4 21.23,38.53 20.32,37.62 20.32,31.11 21.11,30.32 40.8,30.32 42.7,28.42 42.7,22.07 R11.1 | R7.1 67.47,3.02 JP4.6 | R7.1 64.3,11.91 v60.01,11.91 60.01,12.22 55.09,17.14 v54.45,17.14 | U2.VCC 38.42,5.56 37.94,6.03 v35.88,6.03 | v38.26,13.65 38.26,15.71 R8.1 38.42,18.09 38.42,18.1 38.89,18.57 42.22,18.57 R10.1 | R10.1 R9.1 47.16,17.3 49.53,14.92 v50.16,14.92 | R10.1 43.5,20.95 R11.1 | R11.1 | C17.1 46.04,45.37 46.04,43.79 58.13,43.79 60.51,41.41 C16.1 63.98,43.31 v63.98,43.5 | R7.1 69.22,10.48 77.31,10.48 77.63,10.79 77.63,16.35 75.72,16.35 | 75.72,16.35 JP5.3 | R6.1 67.79,20.33 v67.15,19.68 | v67.55,17.22 72.5,17.22 72.61,17.34 74.73,17.34 75.72,16.35 | v51.12,24.77 48.9,26.99 v48.74,26.99 | v47.62,34.77 49.69,36.83 v57.47,36.83
  Bottom 0.152: v60.01,11.91 60,11.89 Q1.3 53.49,14.92 v50.16,14.92 | v35.88,6.03 35.88,12.06 37.47,13.65 v38.26,13.65 | v67.15,19.68 67.15,17.78 67.63,17.3 v67.55,17.22 | v54.45,17.14 54.45,19.68 52.04,22.09 52.04,22.32 51.12,23.24 v51.12,24.77 | v48.74,26.99 48.74,33.66 v47.62,34.77 | v57.47,36.83 64.93,36.83 65.41,37.31 65.41,42.55 64.45,43.5 v63.98,43.5
VALIM  (via drill 0.35)
  Top 0.152: C21.1 52.7,18.89 | 52.7,18.89 54.77,18.89 55.09,18.57 | 55.09,18.57 55.88,17.78 61.92,17.78 R28.1 | Q5.2 37.62,27.79 37.62,29.84 37.78,30 40.64,30 42.39,28.26 42.39,26.48 v42.1,26.19 | v51.44,22.07 52.7,20.8 52.7,18.89 | 55.09,18.57 55.09,20.32 52.07,23.34 52.07,25.4 60.64,25.4 61.59,26.35 v61.59,27.94 | v61.75,34.45 63.34,36.04 v63.98,36.04 | v77.15,50.64 77.24,50.55 U1.7
  Bottom 0.152: v42.1,26.19 42.23,26.06 42.23,25.08 44.77,22.54 50.96,22.54 v51.44,22.07 | v61.59,27.94 61.59,29.84 62.55,30.8 62.55,31.59 61.75,32.38 v61.75,34.45 | v63.98,36.04 64.14,36.2 65.56,36.2 66.04,36.67 66.04,46.2 66.67,46.83 66.83,46.83 67.47,47.47 67.47,50.32 67.79,50.64 v77.15,50.64
VBAT  (via drill 0.35)
  Top 0.152: Q3.2 29.52,10.48 v28.89,10.48 | v38.26,21.59 38.26,22.7 39.52,23.96 R24.1 v40.48,27.78 | v42.86,32.07 44.74,32.07 C20.1 45.72,31.91 46.28,32.46 | 46.28,32.46 46.35,32.54 | 46.28,32.46 59.13,32.46 59.85,31.75 59.85,30.46 60.09,30.22 60.09,26.75 v60.61,26.23 | v61.75,24.92 64.61,24.92 64.77,25.08 v64.77,26.61 | U1.6 78.51,50.1 78.9,50.48 79.5,50.48 v79.53,50.45 | v86.17,30.39 86.17,27.17 86.68,26.67 86.68,21.43 v85.57,20.32 | v81.41,8.89 80.01,10.29 80.01,18.48 79.63,18.86 79.12,18.86 78.68,18.41 77.95,18.41 v77.95,18.26
  Bottom 0.152: v28.89,10.48 30,11.59 30,12.38 30.64,13.02 31.91,13.02 33.02,14.13 33.02,16.03 34.61,17.62 37.31,17.62 38.26,18.57 v38.26,21.59 | v40.48,27.78 40.48,31.11 41.59,32.23 42.7,32.23 v42.86,32.07 | v60.61,26.23 61.75,25.08 v61.75,24.92 | v79.53,50.45 79.82,50.16 85.88,50.16 86.17,49.88 v86.17,30.39 | v81.41,8.89 82.38,9.86 83.47,9.86 85.57,11.95 v85.57,20.32 | v77.95,18.26 76.52,19.68 76.52,20.8 76.2,21.11 67.47,21.11 66.36,22.23 66.36,26.35 66.1,26.61 v64.77,26.61
VCC  (via drill 0.35)
  Top 0.152: U1.2 83.59,51.5 83.26,51.83 | 83.26,51.83 R2.2 | Q4.2 27.01,26.68 28.34,28.02 | 28.34,28.02 R20.2 28.42,29.38 v28.73,29.69 | v76.68,54.77 76.68,56.67 77.31,57.31 81.92,57.31 83.26,55.96 83.26,51.83 | v37.94,52.23 37.94,52.07 v40.48,49.53 | v62.07,50.32 61.28,49.53 52.07,49.53 v51.28,48.74 | v29.53,25.24 28.57,26.19 28.42,26.19 28.34,26.27 28.34,28.02
  Bottom 0.152: JP3.3 27.15,56.67 27.94,55.88 32.38,55.88 34.61,53.66 34.61,53.5 | 34.61,53.5 C1.1 36.86,53.31 v37.94,52.23 | 34.61,53.5 36.2,53.5 36.67,53.98 36.67,57.63 37.78,58.74 41.3,58.74 C15.1 C14.1 45.27,58.87 46.2,57.94 U5.4 | Q1.2 55.56,9.37 53.98,7.78 51.12,7.78 48.58,5.24 U2.CSB 47.47,4.29 47.47,8.26 36.67,8.26 36.67,4.92 36.51,4.76 24.13,4.76 22.86,6.03 22.86,10.95 23.18,11.27 26.67,11.27 26.67,19.94 26.54,20.07 26.54,20.57 26.83,20.86 26.83,22.23 27.94,23.34 R1.1 28.57,23.49 28.57,24.61 29.21,25.24 v29.53,25.24 | v76.68,54.77 76.68,52.23 75.56,51.12 66.99,51.12 65.56,52.55 R5.2 64.13,52.38 v62.07,50.32 | v51.28,48.74 51.28,47.78 51.09,47.6 C2.1 44.48,47.6 42.55,49.53 v40.48,49.53 38.26,49.53 34.29,45.56 34.29,35.24 v28.73,29.69
WIND_DIR  (via drill 0.35)
  Top 0.152: R7.2 70.64,9.05 78.58,9.05 78.82,8.81 | 78.82,8.81 79.22,8.41 J3.5 | 78.82,8.81 78.82,8.97 79.38,9.53 v79.38,18.26 | v64.57,33.18 64.57,34.25 64.78,34.46 U1.24
  Bottom 0.152: v79.38,18.26 79.38,21.75 77.97,23.15 77.97,28.07 78.86,28.07 79.76,27.17 88.2,27.17 88.24,27.21 88.24,28.83 87.28,29.79 83.86,29.79 83.6,29.53 82.87,29.53 82.87,28.73 76.52,28.73 76.2,29.05 76.2,29.53 65.25,29.53 64.57,30.21 v64.57,33.18
WIND_SPEED  (via drill 0.35)
  Top 0.152: R11.2 47.15,20.47 47.15,18.73 49.05,16.83 53.66,16.83 57.15,13.34 58.1,13.34 59.21,12.22 59.21,10.16 63.02,6.35 v64.93,6.35 | v70.96,26.19 70.96,31.1 U1.27
  Bottom 0.152: J3.4 77.15,3.17 75.93,3.17 75.79,3.31 72.25,3.31 69.22,6.35 v64.93,6.35 64.93,10 66.36,11.43 77.95,11.43 78.58,12.06 78.58,20.64 77.79,21.43 73.18,21.43 72.71,21.91 72.71,25.88 72.39,26.19 v70.96,26.19
WS  (via drill 0.35)
  Top 0.152: v65.41,43.81 65.41,36.93 66.02,36.32 66.27,36.32 U1.23 65.25,35.73 63.66,34.13 v63.66,33.5 | v65.41,45.24 65.41,49.21 65.88,49.69 67.83,49.69 U1.14 | v63.82,30.16 64.8,29.18 68.67,29.18 70.3,27.56 70.3,26.05 66.58,26.05 66.13,25.6 66.13,20.09 v66.04,20 | v66.36,16.67 66.41,16.62 72.76,16.62 JP5.4
  Bottom 0.152: v65.41,43.81 v65.41,45.24 | v63.66,33.5 63.82,33.34 v63.82,30.16 | v66.04,20 66.04,16.99 v66.36,16.67

### Text on the board
tNames: GND | Rts | Vcc | Tx | Rx | Dtr